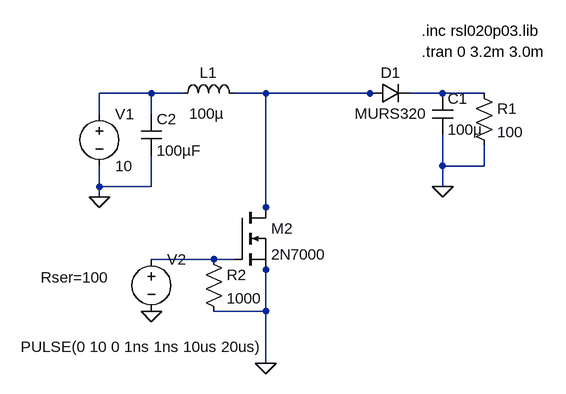
[diagram p0: schematic boost_basic.asc]
boost_basic.asc, the LTspice schematic file:
Version 4
SHEET 1 1368 680
WIRE 48 128 -32 128
WIRE 96 128 48 128
WIRE 224 128 176 128
WIRE 384 128 224 128
WIRE 400 128 384 128
WIRE 496 128 448 128
WIRE 560 128 496 128
WIRE -32 160 -32 128
WIRE 48 160 48 128
WIRE 496 240 496 192
WIRE 560 240 560 208
WIRE 560 240 496 240
WIRE -32 272 -32 240
WIRE 48 272 48 224
WIRE 48 272 -32 272
WIRE 496 272 496 240
WIRE -32 288 -32 272
WIRE 224 304 224 128
WIRE 224 320 224 304
WIRE 144 384 48 384
WIRE 176 384 144 384
WIRE 224 400 224 384
WIRE 224 464 224 400
WIRE 224 464 144 464
WIRE 224 544 224 464
FLAG 48 464 0
FLAG 224 544 0
FLAG 496 272 0
FLAG -32 288 0
SYMBOL voltage -32 144 R0
WINDOW 123 0 0 Left 0
WINDOW 39 0 0 Left 0
SYMATTR InstName V1
SYMATTR Value 10
SYMBOL voltage 48 368 R0
WINDOW 3 -201 151 Left 2
WINDOW 123 0 0 Left 0
WINDOW 39 -170 44 Left 2
SYMATTR Value PULSE(0 10 0 1ns 1ns 10us 20us)
SYMATTR SpiceLine Rser=100
SYMATTR InstName V2
SYMBOL diode 384 144 R270
WINDOW 0 32 32 VTop 2
WINDOW 3 0 32 VBottom 2
SYMATTR InstName D1
SYMATTR Value MURS320
SYMBOL ind 80 144 R270
WINDOW 0 32 56 VTop 2
WINDOW 3 0 53 VBottom 2
SYMATTR InstName L1
SYMATTR Value 100µ
SYMBOL cap 480 128 R0
SYMATTR InstName C1
SYMATTR Value 100µ
SYMBOL cap 32 160 R0
SYMATTR InstName C2
SYMATTR Value 100µF
SYMBOL res 544 112 R0
SYMATTR InstName R1
SYMATTR Value 100
SYMBOL nmos 176 304 R0
SYMATTR InstName M2
SYMATTR Value 2N7000
SYMBOL res 128 368 R0
SYMATTR InstName R2
SYMATTR Value 1000
TEXT 464 32 Left 2 !.inc rsl020p03.lib
TEXT 464 64 Left 2 !.tran 0 3.2m 3.0m

The netlist it stands for:
* boost_basic.asc
V1 N001 0 10
V2 N004 0 PULSE(0 10 0 1ns 1ns 10us 20us) Rser=100
D1 N002 N003 MURS320
L1 N001 N002 100µ
C1 N003 0 100µ
C2 N001 0 100µF
R1 N003 0 100
M2 N002 N004 0 0 2N7000
R2 N004 0 1000
.model D D
.lib standard.dio
.model NMOS NMOS
.model PMOS PMOS
.lib standard.mos
.inc rsl020p03.lib
.tran 0 3.2m 3.0m
.backanno
.end